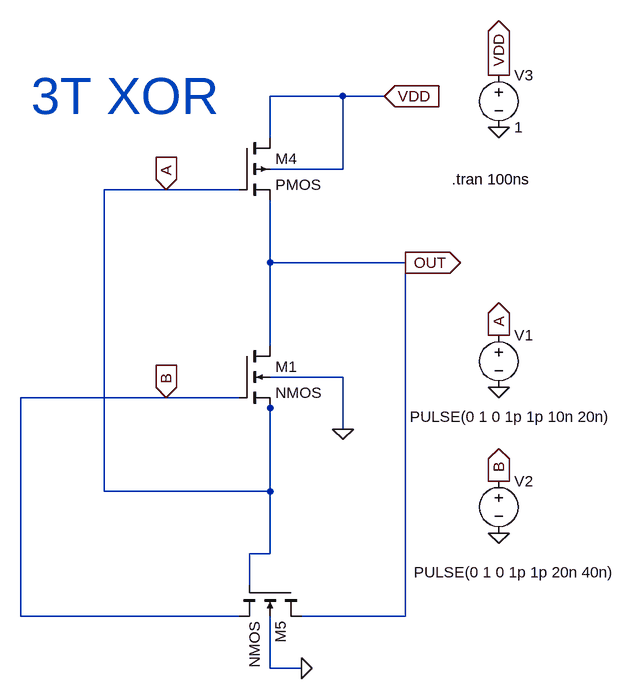
[diagram p0: schematic 3T EXOR.asc]
3T EXOR.asc, the LTspice schematic file:
Version 4
SHEET 1 1128 944
WIRE 544 48 432 48
WIRE 608 48 544 48
WIRE 432 112 432 48
WIRE 544 160 544 48
WIRE 544 160 432 160
WIRE 272 192 176 192
WIRE 384 192 272 192
WIRE 432 304 432 208
WIRE 640 304 432 304
WIRE 432 432 432 304
WIRE 544 480 432 480
WIRE 272 512 48 512
WIRE 384 512 272 512
WIRE 432 528 432 512
WIRE 544 560 544 480
WIRE 176 656 176 192
WIRE 432 656 432 528
WIRE 432 656 176 656
WIRE 432 752 432 656
WIRE 432 752 400 752
WIRE 400 800 400 752
WIRE 48 848 48 512
WIRE 384 848 48 848
WIRE 640 848 640 304
WIRE 640 848 480 848
WIRE 432 928 432 848
WIRE 480 928 432 928
FLAG 544 560 0
FLAG 480 928 0
FLAG 608 48 VDD
IOPIN 608 48 In
FLAG 640 304 OUT
IOPIN 640 304 Out
FLAG 272 512 B
IOPIN 272 512 In
FLAG 272 192 A
IOPIN 272 192 In
FLAG 784 16 VDD
IOPIN 784 16 Out
FLAG 784 96 0
FLAG 784 496 0
FLAG 784 720 0
FLAG 784 416 A
IOPIN 784 416 Out
FLAG 784 640 B
IOPIN 784 640 Out
SYMBOL pmos4 384 112 R0
SYMATTR InstName M4
SYMBOL nmos4 384 432 R0
SYMATTR InstName M1
SYMBOL nmos4 480 800 R90
SYMATTR InstName M5
SYMBOL voltage 784 400 R0
WINDOW 3 -137 141 Left 2
SYMATTR Value PULSE(0 1 0 1p 1p 10n 20n)
SYMATTR InstName V1
SYMBOL voltage 784 624 R0
WINDOW 3 -131 156 Left 2
SYMATTR Value PULSE(0 1 0 1p 1p 20n 40n)
SYMATTR InstName V2
SYMBOL voltage 784 0 R0
SYMATTR InstName V3
SYMATTR Value 1
TEXT 712 176 Left 2 !.tran 100ns
TEXT 64 48 Left 6 ;3T XOR

The netlist it stands for:
* 3T EXOR.asc
M4 VDD A OUT VDD PMOS
M1 OUT B A 0 NMOS
M5 OUT A B 0 NMOS
V1 A 0 PULSE(0 1 0 1p 1p 10n 20n)
V2 B 0 PULSE(0 1 0 1p 1p 20n 40n)
V3 VDD 0 1
.model NMOS NMOS
.model PMOS PMOS
.lib standard.mos
.tran 100ns
* 3T XOR
.backanno
.end